# Altium schematic sheet PAGE1-CONTETNS.SchDoc
size A3
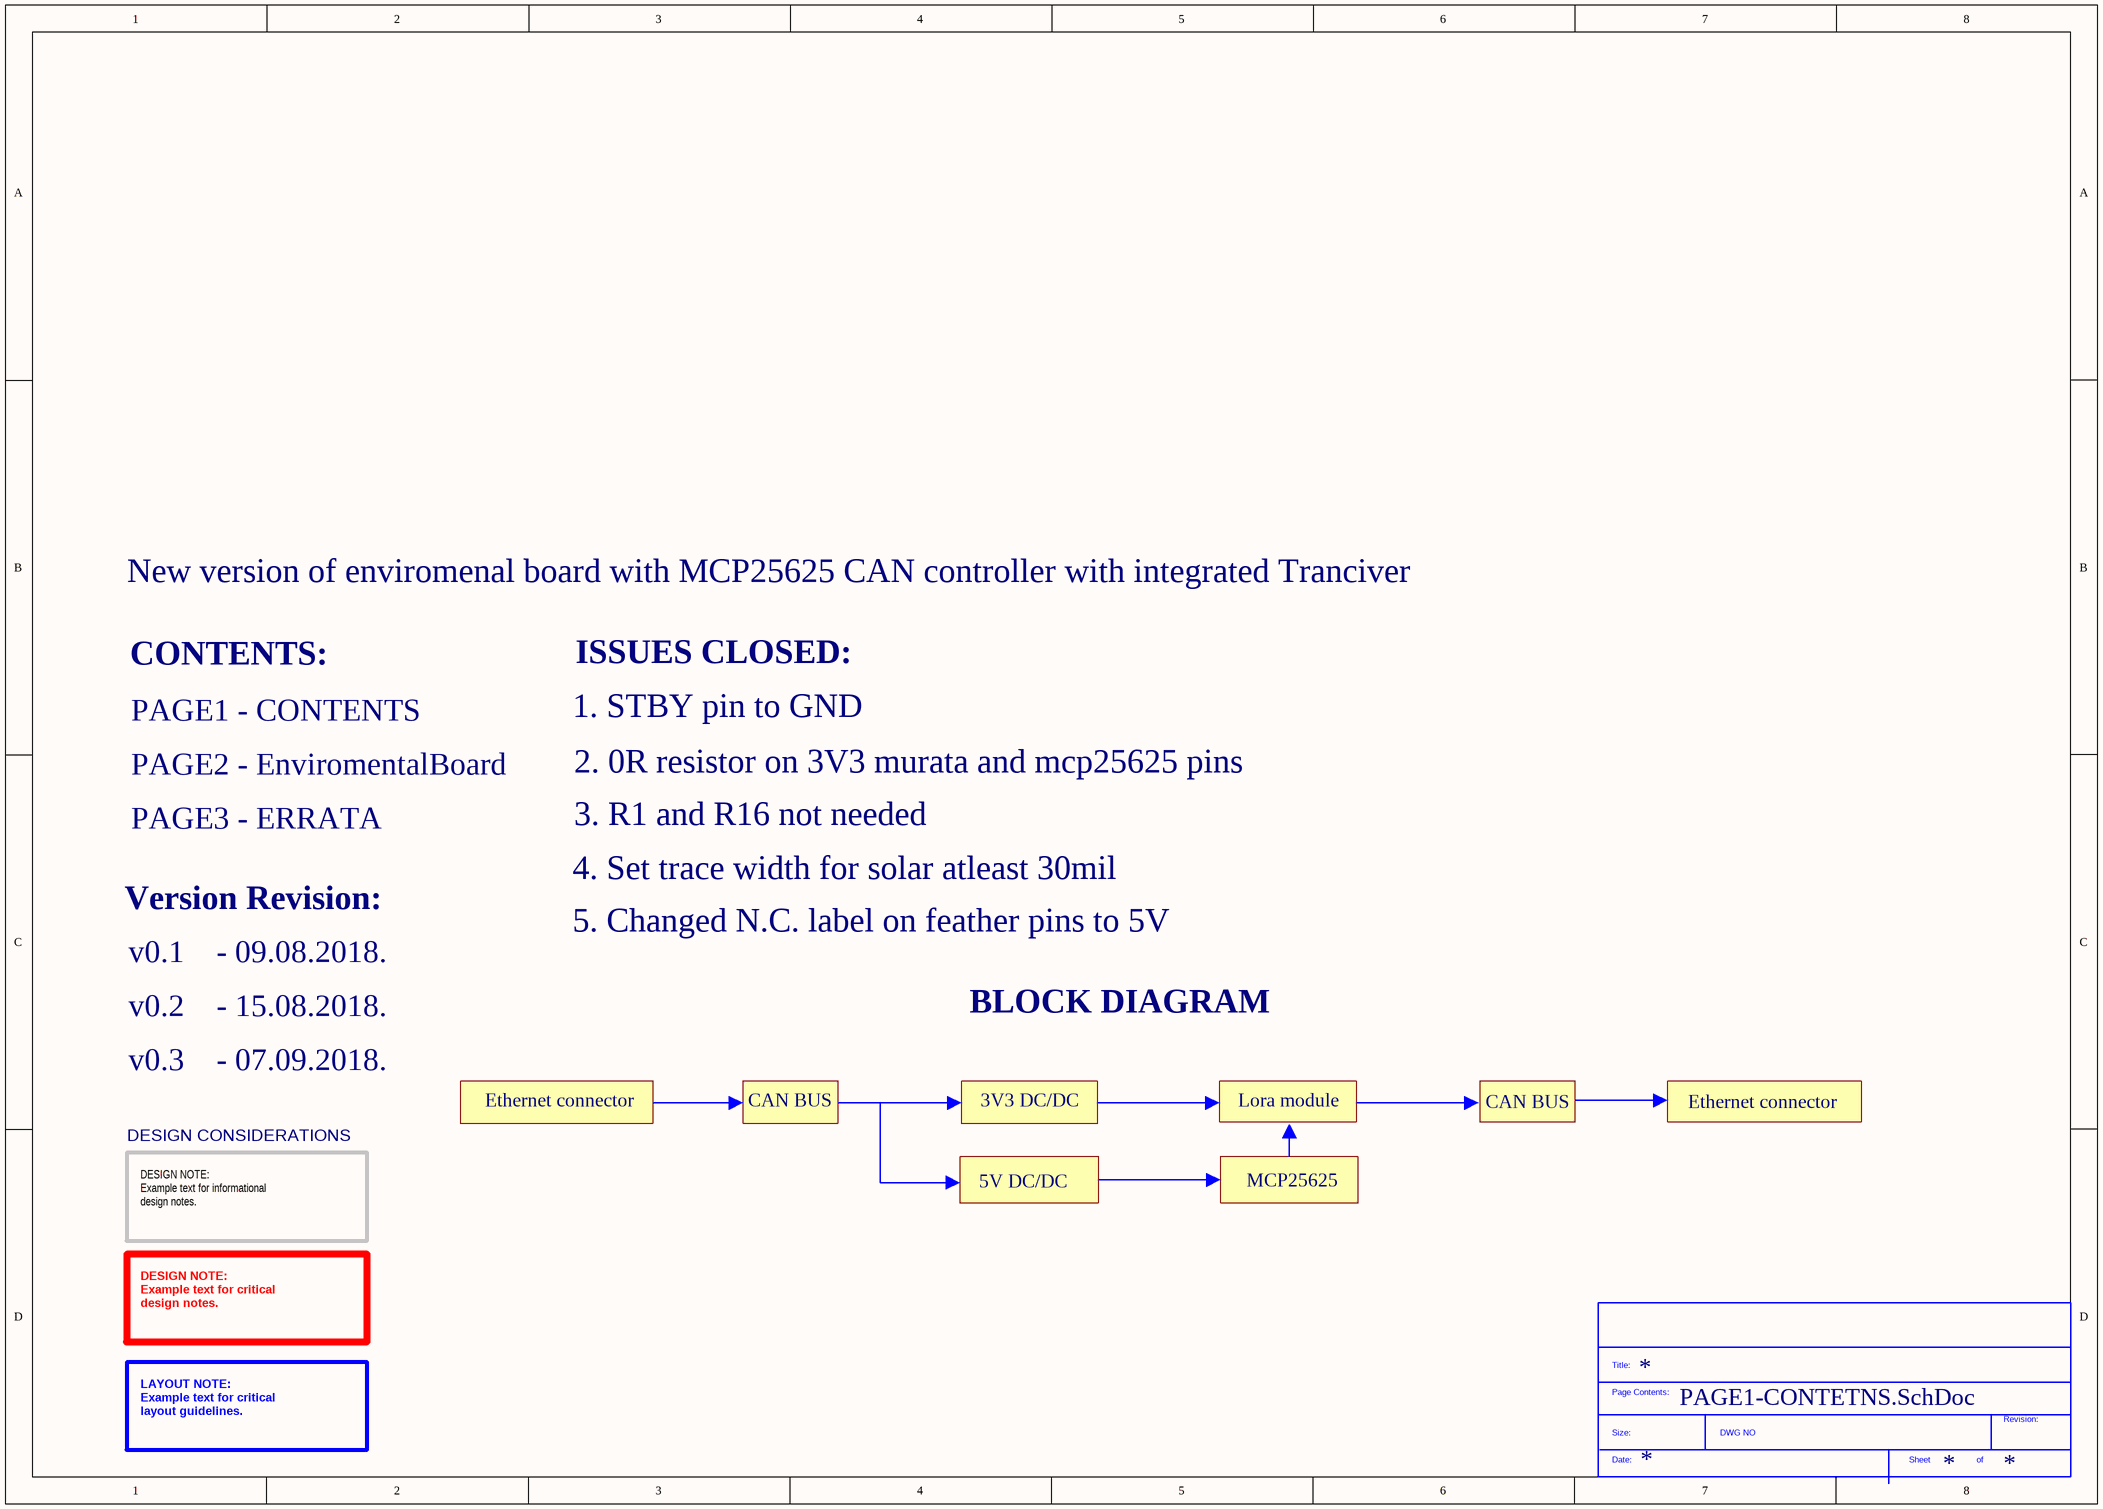
[diagram p0: PAGE1-CONTETNS.SchDoc]

## Parts
*?  SDTitleBlock  (value not drawn)  (graphical)

## Notes on the sheet
- New version of enviromenal board with MCP25625 CAN controller with integrated Tranciver
- CONTENTS:
- 1. STBY pin to GND
- ISSUES CLOSED:
- PAGE1 - CONTENTS
- PAGE2 - EnviromentalBoard
- 2. 0R resistor on 3V3 murata and mcp25625 pins
- PAGE3 - ERRATA
- 3. R1 and R16 not needed
- Version Revision:
- 4. Set trace width for solar atleast 30mil
- v0.1    - 09.08.2018.
- 5. Changed N.C. label on feather pins to 5V
- v0.2    - 15.08.2018.
- BLOCK DIAGRAM
- v0.3    - 07.09.2018.
- Ethernet connector
- CAN BUS
- 3V3 DC/DC
- Lora module
- DESIGN CONSIDERATIONS
- 5V DC/DC
- MCP25625
- DESIGN NOTE:
  Example text for informational
  design notes.
- DESIGN NOTE:
  Example text for critical
  design notes.
- LAYOUT NOTE:
  Example text for critical
  layout guidelines.
- (in symbol SDTitleBlock) Title:; Page Contents:; Revision:; Size:; DWG NO; Date:; Sheet; of